# EAGLE schematic schematic (EAGLE 9.6.2)
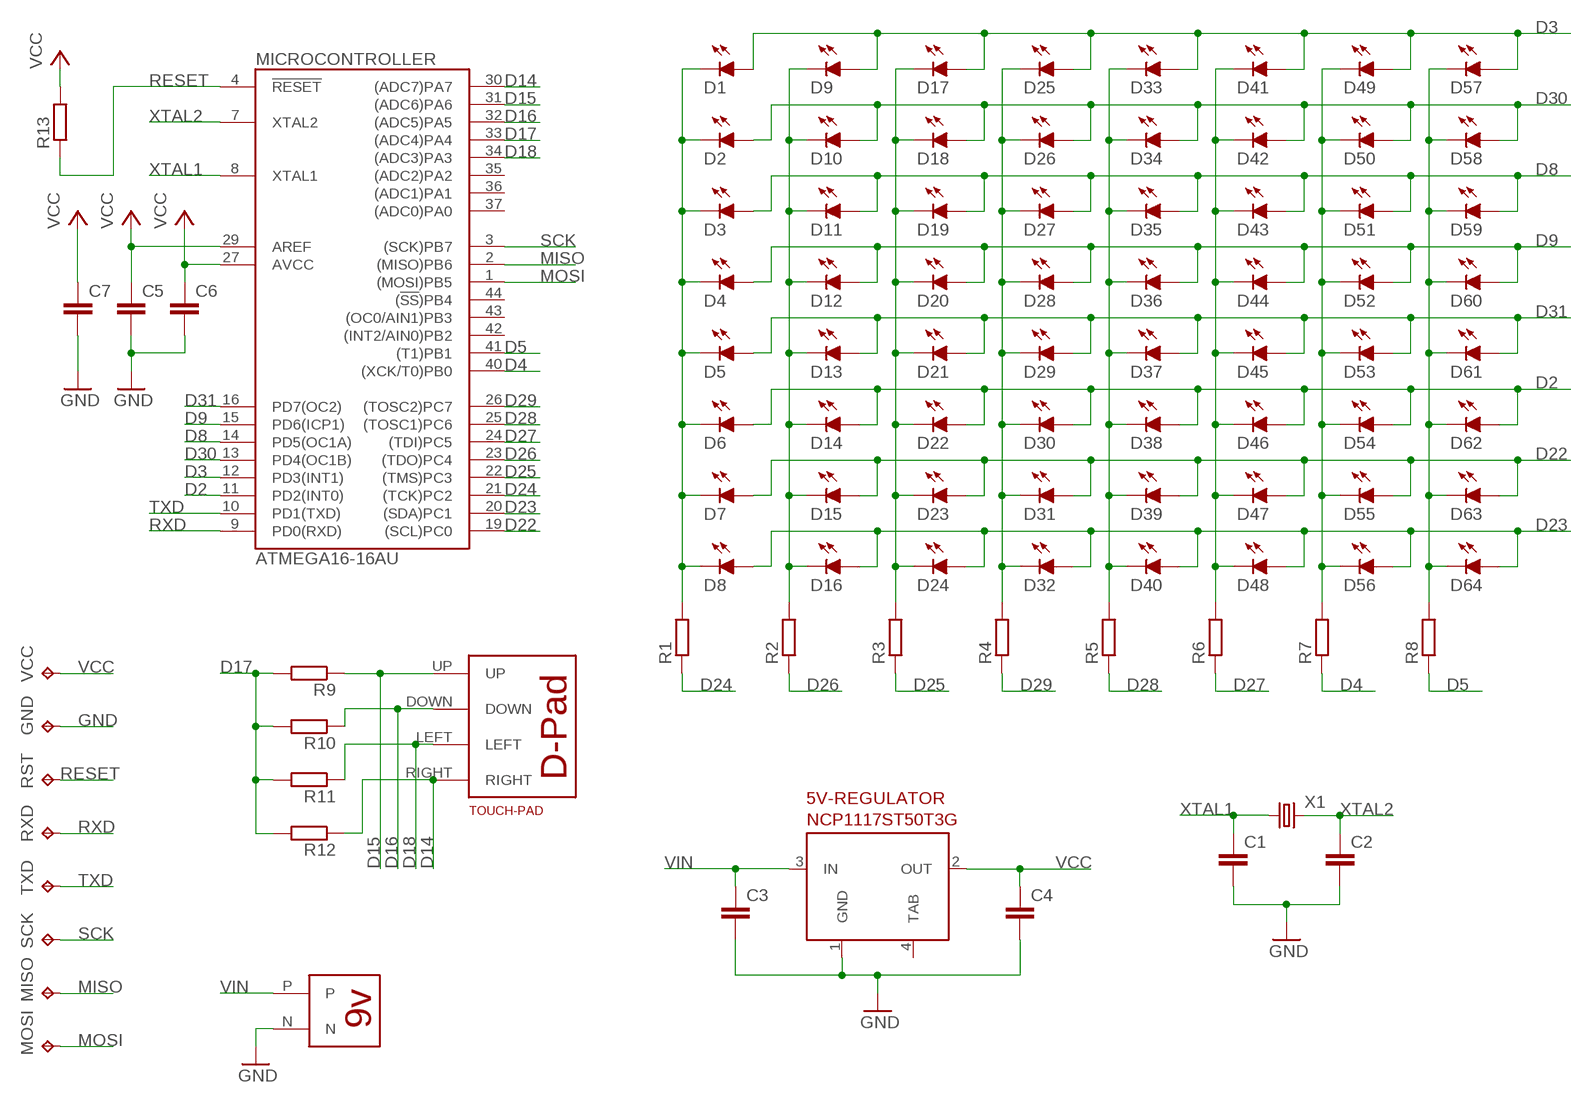
[diagram p0: schematic, sheet 1]

## Parts
5V-REGULATOR  NCP1117ST50T3G  [SOT223]
C1  C-EUC0603  [C0603]
C2  C-EUC0603  [C0603]
C3  C-EUC0603  [C0603]
C4  C-EUC0603  [C0603]
C5  C-EUC0603  [C0603]
C6  C-EUC0603  [C0603]
C7  C-EUC0603  [C0603]
D1  LED_LEDCHIP-LED0603MP  [LED_CHIP-LED0603MP]
D2  LED_LEDCHIP-LED0603MP  [LED_CHIP-LED0603MP]
D3  LED_LEDCHIP-LED0603MP  [LED_CHIP-LED0603MP]
D4  LED_LEDCHIP-LED0603MP  [LED_CHIP-LED0603MP]
D5  LED_LEDCHIP-LED0603MP  [LED_CHIP-LED0603MP]
D6  LED_LEDCHIP-LED0603MP  [LED_CHIP-LED0603MP]
D7  LED_LEDCHIP-LED0603MP  [LED_CHIP-LED0603MP]
D8  LED_LEDCHIP-LED0603MP  [LED_CHIP-LED0603MP]
D9  LED_LEDCHIP-LED0603MP  [LED_CHIP-LED0603MP]
D10  LED_LEDCHIP-LED0603MP  [LED_CHIP-LED0603MP]
D11  LED_LEDCHIP-LED0603MP  [LED_CHIP-LED0603MP]
D12  LED_LEDCHIP-LED0603MP  [LED_CHIP-LED0603MP]
D13  LED_LEDCHIP-LED0603MP  [LED_CHIP-LED0603MP]
D14  LED_LEDCHIP-LED0603MP  [LED_CHIP-LED0603MP]
D15  LED_LEDCHIP-LED0603MP  [LED_CHIP-LED0603MP]
D16  LED_LEDCHIP-LED0603MP  [LED_CHIP-LED0603MP]
D17  LED_LEDCHIP-LED0603MP  [LED_CHIP-LED0603MP]
D18  LED_LEDCHIP-LED0603MP  [LED_CHIP-LED0603MP]
D19  LED_LEDCHIP-LED0603MP  [LED_CHIP-LED0603MP]
D20  LED_LEDCHIP-LED0603MP  [LED_CHIP-LED0603MP]
D21  LED_LEDCHIP-LED0603MP  [LED_CHIP-LED0603MP]
D22  LED_LEDCHIP-LED0603MP  [LED_CHIP-LED0603MP]
D23  LED_LEDCHIP-LED0603MP  [LED_CHIP-LED0603MP]
D24  LED_LEDCHIP-LED0603MP  [LED_CHIP-LED0603MP]
D25  LED_LEDCHIP-LED0603MP  [LED_CHIP-LED0603MP]
D26  LED_LEDCHIP-LED0603MP  [LED_CHIP-LED0603MP]
D27  LED_LEDCHIP-LED0603MP  [LED_CHIP-LED0603MP]
D28  LED_LEDCHIP-LED0603MP  [LED_CHIP-LED0603MP]
D29  LED_LEDCHIP-LED0603MP  [LED_CHIP-LED0603MP]
D30  LED_LEDCHIP-LED0603MP  [LED_CHIP-LED0603MP]
D31  LED_LEDCHIP-LED0603MP  [LED_CHIP-LED0603MP]
D32  LED_LEDCHIP-LED0603MP  [LED_CHIP-LED0603MP]
D33  LED_LEDCHIP-LED0603MP  [LED_CHIP-LED0603MP]
D34  LED_LEDCHIP-LED0603MP  [LED_CHIP-LED0603MP]
D35  LED_LEDCHIP-LED0603MP  [LED_CHIP-LED0603MP]
D36  LED_LEDCHIP-LED0603MP  [LED_CHIP-LED0603MP]
D37  LED_LEDCHIP-LED0603MP  [LED_CHIP-LED0603MP]
D38  LED_LEDCHIP-LED0603MP  [LED_CHIP-LED0603MP]
D39  LED_LEDCHIP-LED0603MP  [LED_CHIP-LED0603MP]
D40  LED_LEDCHIP-LED0603MP  [LED_CHIP-LED0603MP]
D41  LED_LEDCHIP-LED0603MP  [LED_CHIP-LED0603MP]
D42  LED_LEDCHIP-LED0603MP  [LED_CHIP-LED0603MP]
D43  LED_LEDCHIP-LED0603MP  [LED_CHIP-LED0603MP]
D44  LED_LEDCHIP-LED0603MP  [LED_CHIP-LED0603MP]
D45  LED_LEDCHIP-LED0603MP  [LED_CHIP-LED0603MP]
D46  LED_LEDCHIP-LED0603MP  [LED_CHIP-LED0603MP]
D47  LED_LEDCHIP-LED0603MP  [LED_CHIP-LED0603MP]
D48  LED_LEDCHIP-LED0603MP  [LED_CHIP-LED0603MP]
D49  LED_LEDCHIP-LED0603MP  [LED_CHIP-LED0603MP]
D50  LED_LEDCHIP-LED0603MP  [LED_CHIP-LED0603MP]
D51  LED_LEDCHIP-LED0603MP  [LED_CHIP-LED0603MP]
D52  LED_LEDCHIP-LED0603MP  [LED_CHIP-LED0603MP]
D53  LED_LEDCHIP-LED0603MP  [LED_CHIP-LED0603MP]
D54  LED_LEDCHIP-LED0603MP  [LED_CHIP-LED0603MP]
D55  LED_LEDCHIP-LED0603MP  [LED_CHIP-LED0603MP]
D56  LED_LEDCHIP-LED0603MP  [LED_CHIP-LED0603MP]
D57  LED_LEDCHIP-LED0603MP  [LED_CHIP-LED0603MP]
D58  LED_LEDCHIP-LED0603MP  [LED_CHIP-LED0603MP]
D59  LED_LEDCHIP-LED0603MP  [LED_CHIP-LED0603MP]
D60  LED_LEDCHIP-LED0603MP  [LED_CHIP-LED0603MP]
D61  LED_LEDCHIP-LED0603MP  [LED_CHIP-LED0603MP]
D62  LED_LEDCHIP-LED0603MP  [LED_CHIP-LED0603MP]
D63  LED_LEDCHIP-LED0603MP  [LED_CHIP-LED0603MP]
D64  LED_LEDCHIP-LED0603MP  [LED_CHIP-LED0603MP]
GND  TPB2,54  [B2,54]
MICROCONTROLLER  ATMEGA16-16AU  [QFP44_10X10_0.80]
MISO  TPB2,54  [B2,54]
MOSI  TPB2,54  [B2,54]
R1  R-EU_R0603  [R0603]
R2  R-EU_R0603  [R0603]
R3  R-EU_R0603  [R0603]
R4  R-EU_R0603  [R0603]
R5  R-EU_R0603  [R0603]
R6  R-EU_R0603  [R0603]
R7  R-EU_R0603  [R0603]
R8  R-EU_R0603  [R0603]
R9  R-EU_R0603  [R0603]
R10  R-EU_R0603  [R0603]
R11  R-EU_R0603  [R0603]
R12  R-EU_R0603  [R0603]
R13  R-EU_R0603  [R0603]
RST  TPB2,54  [B2,54]
RXD  TPB2,54  [B2,54]
SCK  TPB2,54  [B2,54]
TOUCH-PAD  DPAD  [D-PAD]
TXD  TPB2,54  [B2,54]
U$1  BAT  [BAT]
VCC  TPB2,54  [B2,54]
X1  X322516MLB4SI  [SMD3225]

## Nets
D2: D6.A D14.A D22.A D30.A D38.A D46.A D54.A D62.A MICROCONTROLLER.11(PD2(INT0))
D3: D1.A D9.A D17.A D25.A D33.A D41.A D49.A D57.A MICROCONTROLLER.12(PD3(INT1))
D4: MICROCONTROLLER.40((XCK/T0)PB0) R7.1
D5: MICROCONTROLLER.41((T1)PB1) R8.1
D8: D3.A D11.A D19.A D27.A D35.A D43.A D51.A D59.A MICROCONTROLLER.14(PD5(OC1A))
D9: D4.A D12.A D20.A D28.A D36.A D44.A D52.A D60.A MICROCONTROLLER.15(PD6(ICP1))
D14: MICROCONTROLLER.30((ADC7)PA7) R12.1 TOUCH-PAD.RIGHT
D15: MICROCONTROLLER.31((ADC6)PA6) R9.1 TOUCH-PAD.UP
D16: MICROCONTROLLER.32((ADC5)PA5) R10.1 TOUCH-PAD.DOWN
D17: MICROCONTROLLER.33((ADC4)PA4) R9.2 R10.2 R11.2 R12.2
D18: MICROCONTROLLER.34((ADC3)PA3) R11.1 TOUCH-PAD.LEFT
D22: D7.A D15.A D23.A D31.A D39.A D47.A D55.A D63.A MICROCONTROLLER.19((SCL)PC0)
D23: D8.A D16.A D24.A D32.A D40.A D48.A D56.A D64.A MICROCONTROLLER.20((SDA)PC1)
D24: MICROCONTROLLER.21((TCK)PC2) R1.1
D25: MICROCONTROLLER.22((TMS)PC3) R3.1
D26: MICROCONTROLLER.23((TDO)PC4) R2.1
D27: MICROCONTROLLER.24((TDI)PC5) R6.1
D28: MICROCONTROLLER.25((TOSC1)PC6) R5.1
D29: MICROCONTROLLER.26((TOSC2)PC7) R4.1
D30: D2.A D10.A D18.A D26.A D34.A D42.A D50.A D58.A MICROCONTROLLER.13(PD4(OC1B))
D31: D5.A D13.A D21.A D29.A D37.A D45.A D53.A D61.A MICROCONTROLLER.16(PD7(OC2))
GND: 5V-REGULATOR.1(GND) C1.2 C2.2 C3.2 C4.2 C5.2 C6.2 C7.2 GND.TP U$1.N
MISO: MICROCONTROLLER.2((MISO)PB6) MISO.TP
MOSI: MICROCONTROLLER.1((MOSI)PB5) MOSI.TP
N$1: D1.C D2.C D3.C D4.C D5.C D6.C D7.C D8.C R1.2
N$2: D9.C D10.C D11.C D12.C D13.C D14.C D15.C D16.C R2.2
N$3: D17.C D18.C D19.C D20.C D21.C D22.C D23.C D24.C R3.2
N$4: D25.C D26.C D27.C D28.C D29.C D30.C D31.C D32.C R4.2
N$5: D33.C D34.C D35.C D36.C D37.C D38.C D39.C D40.C R5.2
N$6: D41.C D42.C D43.C D44.C D45.C D46.C D47.C D48.C R6.2
N$7: D49.C D50.C D51.C D52.C D53.C D54.C D55.C D56.C R7.2
N$8: D57.C D58.C D59.C D60.C D61.C D62.C D63.C D64.C R8.2
RESET: MICROCONTROLLER.4(!RESET) R13.1 RST.TP
RXD: MICROCONTROLLER.9(PD0(RXD)) RXD.TP
SCK: MICROCONTROLLER.3((SCK)PB7) SCK.TP
TXD: MICROCONTROLLER.10(PD1(TXD)) TXD.TP
VCC: 5V-REGULATOR.2(OUT) C4.1 C5.1 C6.1 C7.1 MICROCONTROLLER.27(AVCC) MICROCONTROLLER.29(AREF) R13.2 VCC.TP
VIN: 5V-REGULATOR.3(IN) C3.1 U$1.P
XTAL1: C1.1 MICROCONTROLLER.8(XTAL1) X1.1
XTAL2: C2.1 MICROCONTROLLER.7(XTAL2) X1.3
Unconnected: 5V-REGULATOR.4(TAB) MICROCONTROLLER.35((ADC2)PA2) MICROCONTROLLER.36((ADC1)PA1) MICROCONTROLLER.37((ADC0)PA0) MICROCONTROLLER.42((INT2/AIN0)PB2) MICROCONTROLLER.43((OC0/AIN1)PB3) MICROCONTROLLER.44((!SS!)PB4)

## Power pins joined to a net without a drawn wire
GND: MICROCONTROLLER.6(GND) MICROCONTROLLER.18(GND) MICROCONTROLLER.28(GND) MICROCONTROLLER.39(GND)
VCC: MICROCONTROLLER.5(VCC) MICROCONTROLLER.17(VCC) MICROCONTROLLER.38(VCC)

## Library data of the parts
5V-REGULATOR = NCP1117ST50T3G:NCP1117ST50T3G: NCP1117 5V, 1.0 A Low-Dropout Positive Fixed and Adjustable Voltage Regulator Datasheet <http://www.onsemi.com/pub_link/Collateral/NCP1117-D.PDF>; AVAILABILITY: Good; DESCRIPTION: 1.0 A Positive LDO Linear Voltage Regulator (Fixed and Adjustable) Vout: 5.0 V; MF: ON Semiconductor; MP: NCP1117ST50T3G; PACKAGE: TO-261-4 ON Semiconductor; PRICE: 0.22 USD
C1-C7 = rcl:C-EU: CAPACITOR, European symbol; SPICEPREFIX: C
D1-D64 = 52101-101-REV-A:LED_LED: LED Various Types
GND MISO MOSI RST RXD SCK TXD VCC = testpad:TP: Test pad
MICROCONTROLLER = atmel:ATMEGA16: 8-bit AVR Microcontroller 16 Kbytes FLASH 1 kbytes SRAM 512 bytes EEPROM USART 8-channel 10 bit ADC
R1-R13 = rcl:R-EU_: RESISTOR, European symbol; SPICEPREFIX: R
TOUCH-PAD = dpad:DPAD
U$1 = 9vbat:BAT
X1 = X322516MLB4SI:X322516MLB4SI; AVAILABILITY: Unavailable; DESCRIPTION: External dimensions: 3.2 x 2.5 x 0.8 mm. Frequency range: 11.0592MHz ~54MHz; MF: YXC; MP: X322516MLB4SI; PACKAGE: Package; PRICE: None